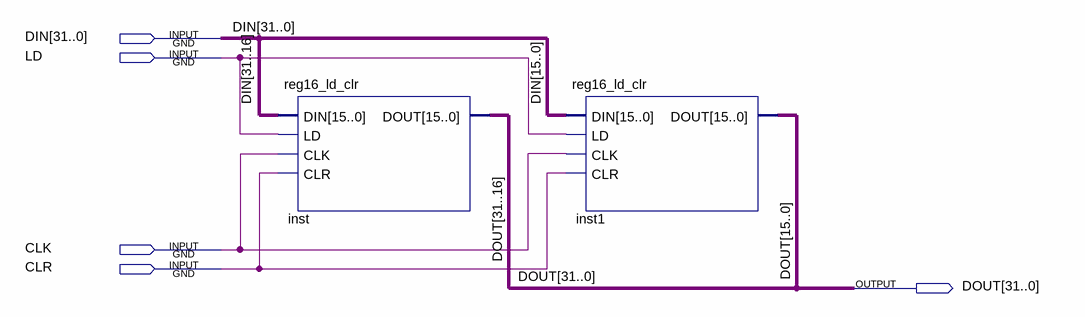
[diagram p0: schematic sheet]
// Quartus schematic reg32_ld_clr.bdf as structural Verilog: 2 symbols, 5 pins
module reg32_ld_clr (
  input  [31:0] DIN,
  input  LD,
  input  CLK,
  input  CLR,
  output [31:0] DOUT
);

  reg16_ld_clr inst (.DIN(DIN[31:16]), .LD(LD), .CLK(CLK), .CLR(CLR), .DOUT(DOUT[31:16]));
  reg16_ld_clr inst1 (.DIN(DIN[15:0]), .LD(LD), .CLK(CLK), .CLR(CLR), .DOUT(DOUT[15:0]));
endmodule
